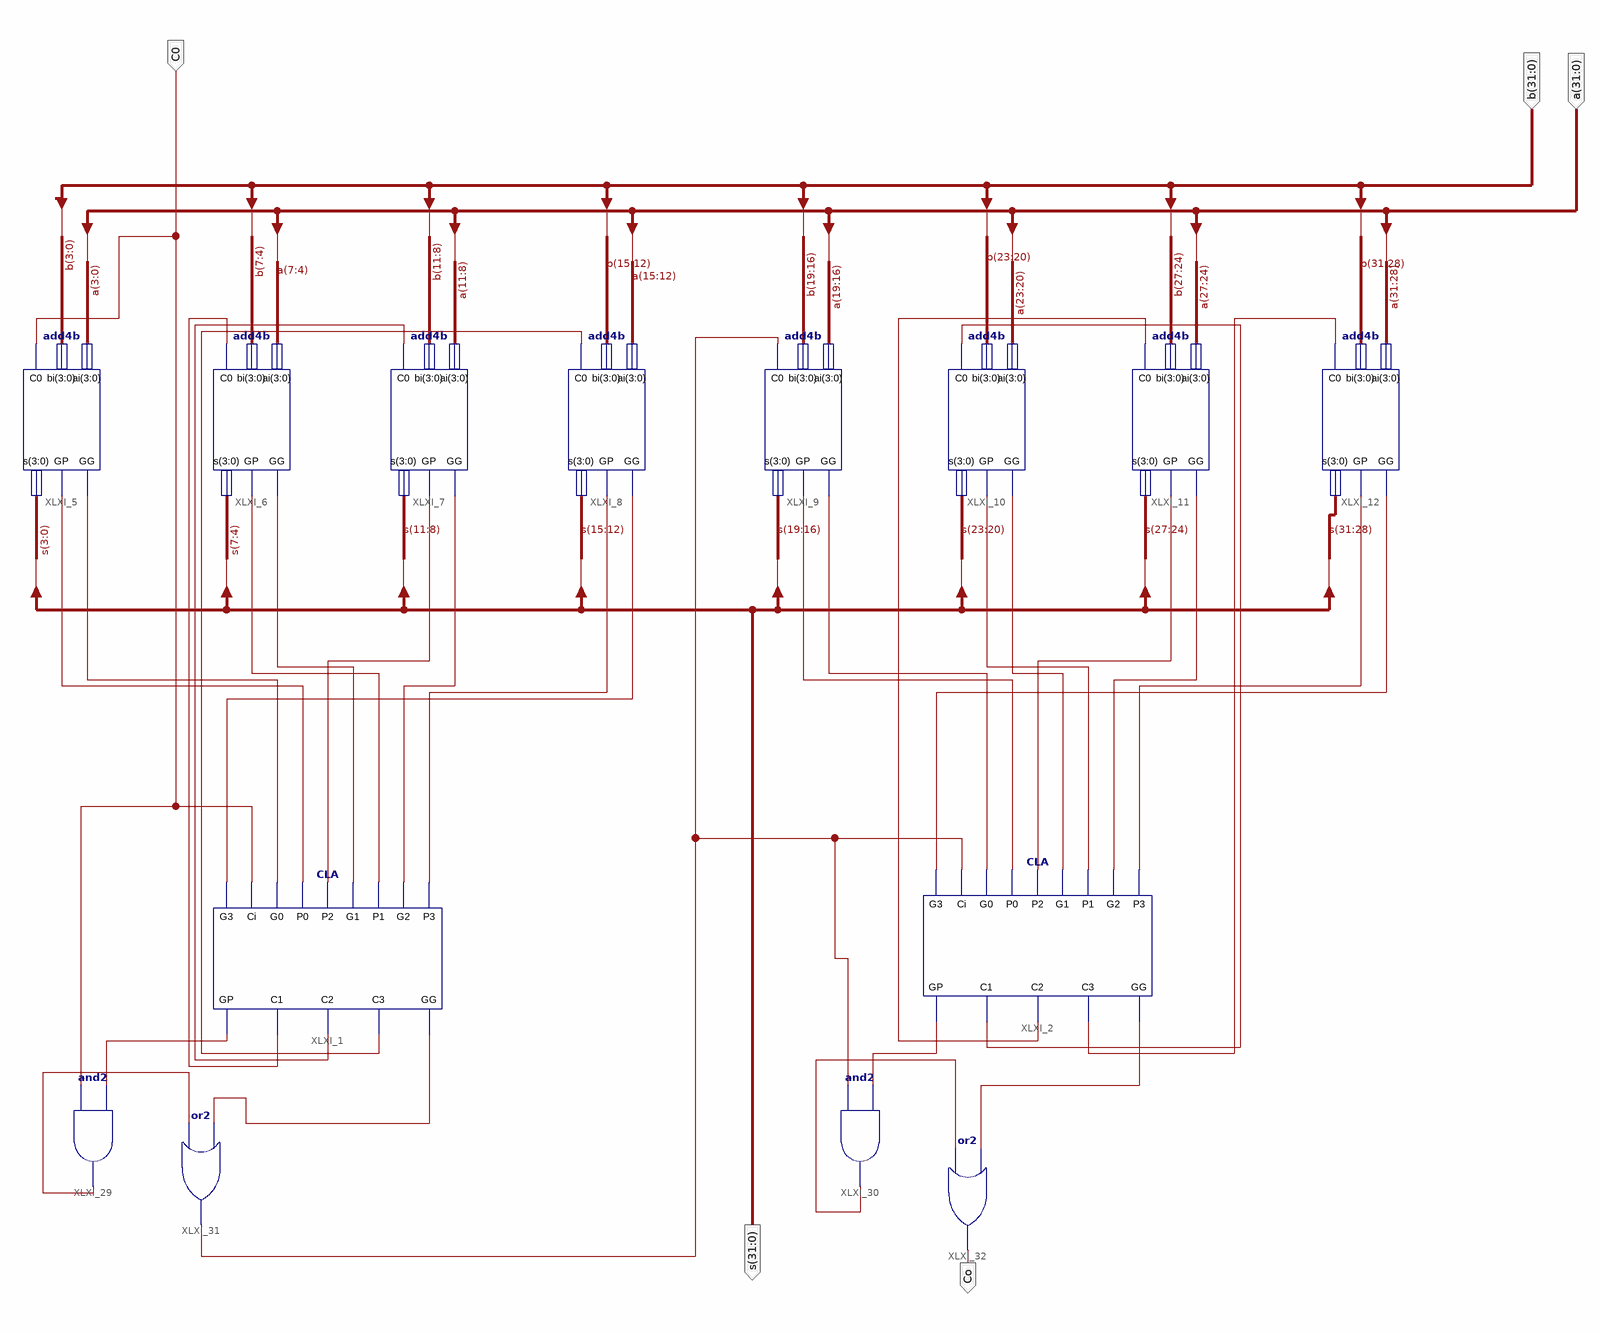
[diagram p0: schematic sheet 1]
// Xilinx ISE schematic adc32.sch (kintex7) as structural Verilog: 14 symbols, 5 ports
module adc32 (
  input  [31:0] b,
  input  [31:0] a,
  input  C0,
  output [31:0] s,
  output Co
);

  wire XLXN_35, XLXN_36, XLXN_37, XLXN_38, XLXN_39, XLXN_40, XLXN_41, XLXN_42, XLXN_43, XLXN_44, XLXN_45,
       XLXN_46, XLXN_47, XLXN_53, XLXN_54, XLXN_55, XLXN_58, XLXN_59, XLXN_60, XLXN_62, XLXN_63, XLXN_64,
       XLXN_66, XLXN_67, XLXN_68, XLXN_72, XLXN_73, XLXN_74, XLXN_75;

  CLA XLXI_1 (
    .P3(XLXN_41), .G2(XLXN_40), .P1(XLXN_37), .G1(XLXN_38), .P2(XLXN_39), .P0(XLXN_35), .G0(XLXN_36),
    .Ci(C0), .G3(XLXN_42), .GG(XLXN_68), .C3(XLXN_60), .C2(XLXN_59), .C1(XLXN_58), .GP(XLXN_66));
  CLA XLXI_2 (
    .P3(XLXN_54), .G2(XLXN_53), .P1(XLXN_45), .G1(XLXN_46), .P2(XLXN_47), .P0(XLXN_43), .G0(XLXN_44),
    .Ci(XLXN_72), .G3(XLXN_55), .GG(XLXN_75), .C3(XLXN_64), .C2(XLXN_63), .C1(XLXN_62), .GP(XLXN_73));
  add4b XLXI_7 (.ai(a[11:8]), .bi(b[11:8]), .C0(XLXN_59), .GG(XLXN_40), .GP(XLXN_39), .s(s[11:8]));
  add4b XLXI_6 (.ai(a[7:4]), .bi(b[7:4]), .C0(XLXN_58), .GG(XLXN_38), .GP(XLXN_37), .s(s[7:4]));
  add4b XLXI_8 (.ai(a[15:12]), .bi(b[15:12]), .C0(XLXN_60), .GG(XLXN_42), .GP(XLXN_41), .s(s[15:12]));
  add4b XLXI_9 (.ai(a[19:16]), .bi(b[19:16]), .C0(XLXN_72), .GG(XLXN_44), .GP(XLXN_43), .s(s[19:16]));
  add4b XLXI_10 (.ai(a[23:20]), .bi(b[23:20]), .C0(XLXN_62), .GG(XLXN_46), .GP(XLXN_45), .s(s[23:20]));
  add4b XLXI_5 (.ai(a[3:0]), .bi(b[3:0]), .C0(C0), .GG(XLXN_36), .GP(XLXN_35), .s(s[3:0]));
  add4b XLXI_11 (.ai(a[27:24]), .bi(b[27:24]), .C0(XLXN_63), .GG(XLXN_53), .GP(XLXN_47), .s(s[27:24]));
  add4b XLXI_12 (.ai(a[31:28]), .bi(b[31:28]), .C0(XLXN_64), .GG(XLXN_55), .GP(XLXN_54), .s(s[31:28]));
  and XLXI_29 (XLXN_67, C0, XLXN_66);
  and XLXI_30 (XLXN_74, XLXN_72, XLXN_73);
  or XLXI_31 (XLXN_72, XLXN_67, XLXN_68);
  or XLXI_32 (Co, XLXN_74, XLXN_75);
endmodule
